# EAGLE design board (EAGLE 9.6.2)
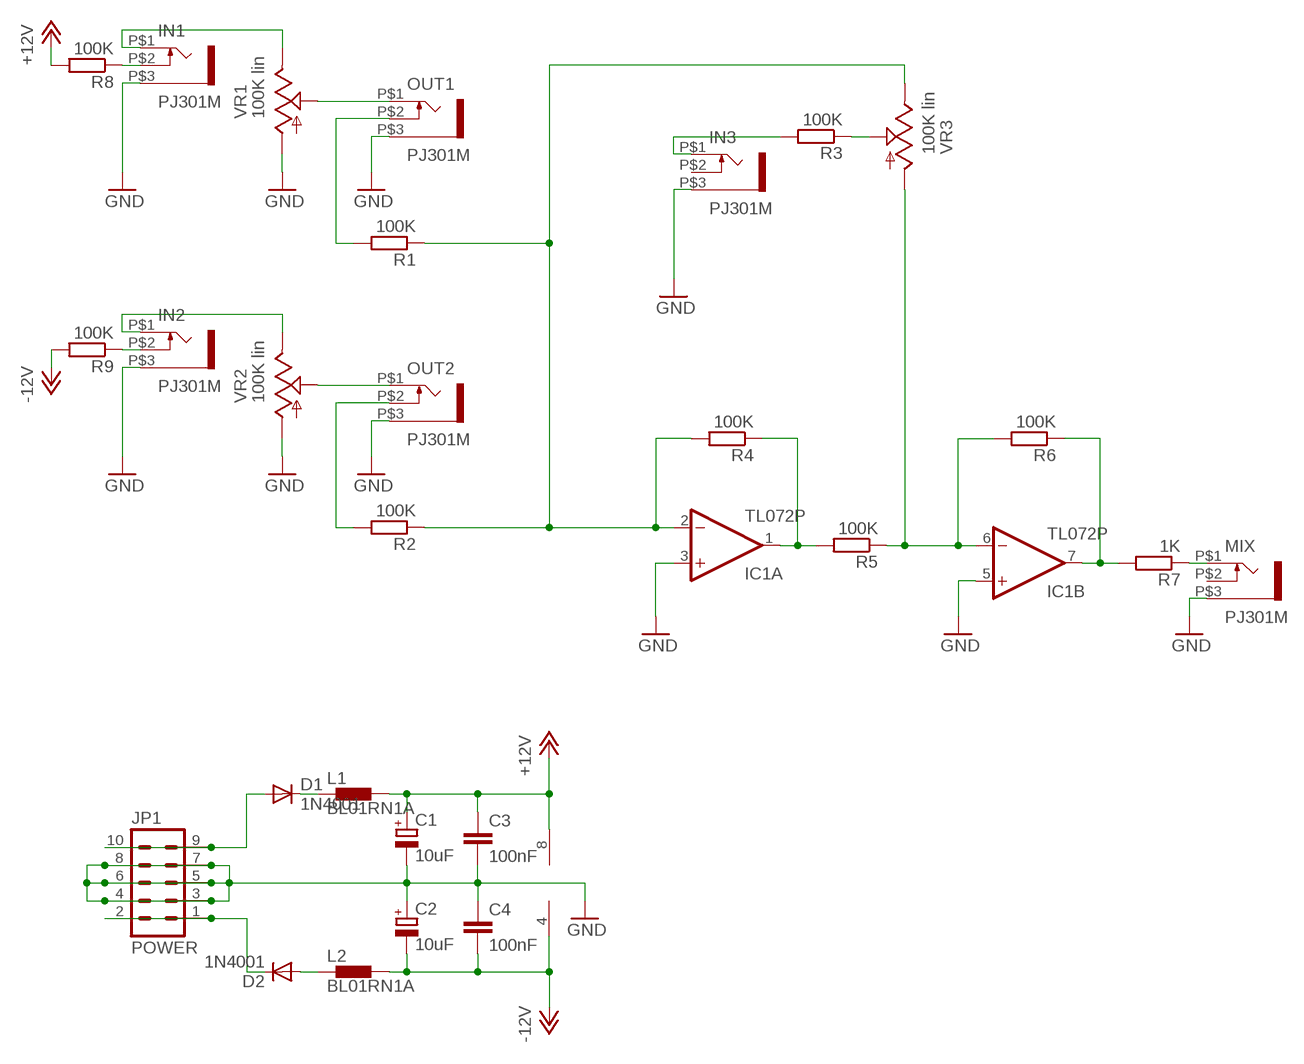
[diagram p0: schematic, sheet 1]

## Parts
C1  10uF  CPOL-EUE2,5-6E  [E2,5-6E]
C2  10uF  CPOL-EUE2,5-6E  [E2,5-6E]
C3  100nF  C-EU025-024X044  [C025-024X044]
C4  100nF  C-EU025-024X044  [C025-024X044]
D1  1N4001  1N4004  [DO41-10]
D2  1N4001  1N4004  [DO41-10]
IC1  TL072P  [DIL08]
IN1  PJ301M  WQP-PJ301M-12_JACK  [WQP-PJ301M-12_JACK]
IN2  PJ301M  WQP-PJ301M-12_JACK  [WQP-PJ301M-12_JACK]
IN3  PJ301M  WQP-PJ301M-12_JACK  [WQP-PJ301M-12_JACK]
JP1  POWER  EURO_POWER_HEADERFAT_PADS  [EURO_PWR_HEADER_FAT]
L1  BL01RN1A  [BL01RN1A]
L2  BL01RN1A  [BL01RN1A]
MIX  PJ301M  WQP-PJ301M-12_JACK  [WQP-PJ301M-12_JACK]
OUT1  PJ301M  WQP-PJ301M-12_JACK  [WQP-PJ301M-12_JACK]
OUT2  PJ301M  WQP-PJ301M-12_JACK  [WQP-PJ301M-12_JACK]
R1  100K  R-EU_0204/5  [0204/5]
R2  100K  R-EU_0204/5  [0204/5]
R3  100K  R-EU_0204/5  [0204/5]
R4  100K  R-EU_0204/5  [0204/5]
R5  100K  R-EU_0204/5  [0204/5]
R6  100K  R-EU_0204/5  [0204/5]
R7  1K  R-EU_0204/5  [0204/5]
R8  100K  R-EU_0204/5  [0204/5]
R9  100K  R-EU_0204/5  [0204/5]
VR1  100K lin  9MM_SNAP-IN_POT_  [9MM_SNAP-IN_POT]
VR2  100K lin  9MM_SNAP-IN_POT_  [9MM_SNAP-IN_POT]
VR3  100K lin  9MM_SNAP-IN_POT_  [9MM_SNAP-IN_POT]

## Nets
+12V: C1.+ C3.1 IC1.8(P:V+) L1.2 R8.2
-12V: C2.- C4.2 IC1.4(P:V-) L2.2 R9.2
GND: C1.- C2.+ C3.2 C4.1 IC1.3(A:+IN) IC1.5(B:+IN) IN1.P$3 IN2.P$3 IN3.P$3 JP1.3 JP1.4 JP1.5 JP1.6 JP1.7 JP1.8 MIX.P$3 OUT1.P$3 OUT2.P$3 VR1.1(A) VR2.1(A)
MIX+: MIX.P$1 R7.1
MIXER: IC1.2(A:-IN) R1.1 R2.1 R4.2 VR3.3(E)
N$1: D1.A JP1.9 JP1.10
N$2: D2.C JP1.1 JP1.2
N$3: D1.C L1.1
N$4: D2.A L2.1
N$5: IN1.P$1 VR1.3(E)
N$6: IN2.P$1 VR2.3(E)
N$7: OUT1.P$1 VR1.2(S)
N$8: OUT2.P$1 VR2.2(S)
N$9: IN3.P$1 R3.2
N$10: R3.1 VR3.2(S)
N$11: IN2.P$2 R9.1
N$12: IN1.P$2 R8.1
N$14: OUT1.P$2 R1.2
N$15: OUT2.P$2 R2.2
N$19: IC1.1(A:OUT) R4.1 R5.2
N$20: IC1.6(B:-IN) R5.1 R6.2 VR3.1(A)
N$21: IC1.7(B:OUT) R6.1 R7.2
Unconnected: IN3.P$2 MIX.P$2

## Library data of the parts
C1 C2 = rcl:CPOL-EU: POLARIZED CAPACITOR, European symbol; MF: NICHICON; MPN: UVR2A100MED1TD; OC_FARNELL: 1822773; SPICEPREFIX: C
C3 C4 = rcl:C-EU: CAPACITOR, European symbol; MF: MULTICOMP; MPN: MC0805Y104M500A2.54MM; OC_FARNELL: 2112751; SPICEPREFIX: C
D1 D2 = diode:1N4004: DIODE general purpose rectifier, 1 A; MF: VISHAY; MPN: 1N4001-E3/54; OC_FARNELL: 2889052
IC1 = linear:TL072: OP AMP; MF: TEXAS INSTRUMENTS; MPN: TL072IP; OC_FARNELL: 3117794
IN1-IN3 MIX OUT1 OUT2 = thonkiconn:WQP-PJ301M-12_JACK; OC_FARNELL: unknown
JP1 = MusicThingModular:EURO_POWER_HEADER: Power Header 10 pin power header for Eurorack Power Supplies Variants with fatter pads for easier soldering, and the LOCK variant which has 5mil offset pins to hold the component in place before soldering; MF: MULTICOMP PRO; MPN: 2213S-10G; OC_FARNELL: 1593442
L1 L2 = inductors:BL0: Noise Suppression Products/EMI Suppression Filters, Lead EMIFIL(R) Inductor Type Source: http://www.murata.com .. BL01RN1_DS.pdf; MF: MURATA; MPN: BL01RN1A1D2B; OC_FARNELL: 9526820
R1-R6 R8 R9 = rcl:R-EU_: RESISTOR, European symbol; MF: TE CONNECTIVITY; MPN: LR0204F100K; OC_FARNELL: 2329853; SPICEPREFIX: R
R7 = rcl:R-EU_: RESISTOR, European symbol; MF: TE CONNECTIVITY; MPN: LR0204F1K0; OC_FARNELL: 2329885; SPICEPREFIX: R
VR1-VR3 = MusicThingModular:9MM_SNAP-IN_POT: 9mm vertical snap-in pot, Alpha / Panasonic style; OC_FARNELL: unknown

## Board
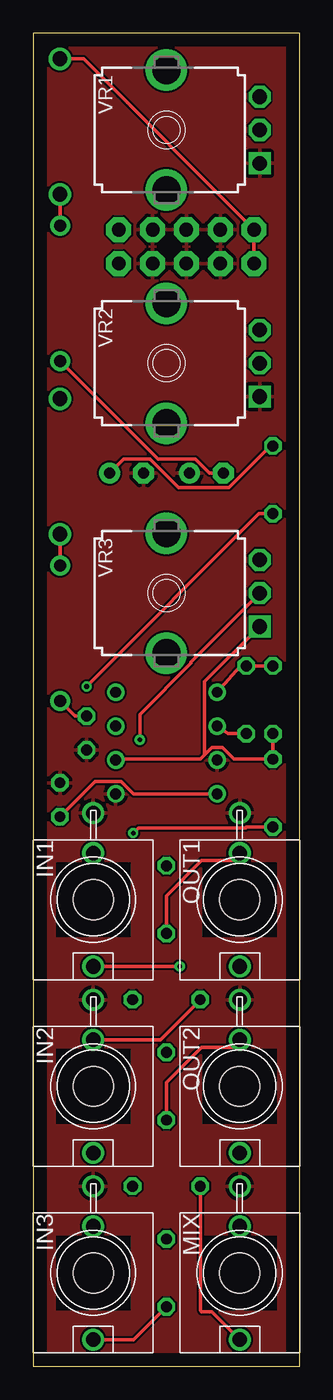
[diagram p1: board, top side]
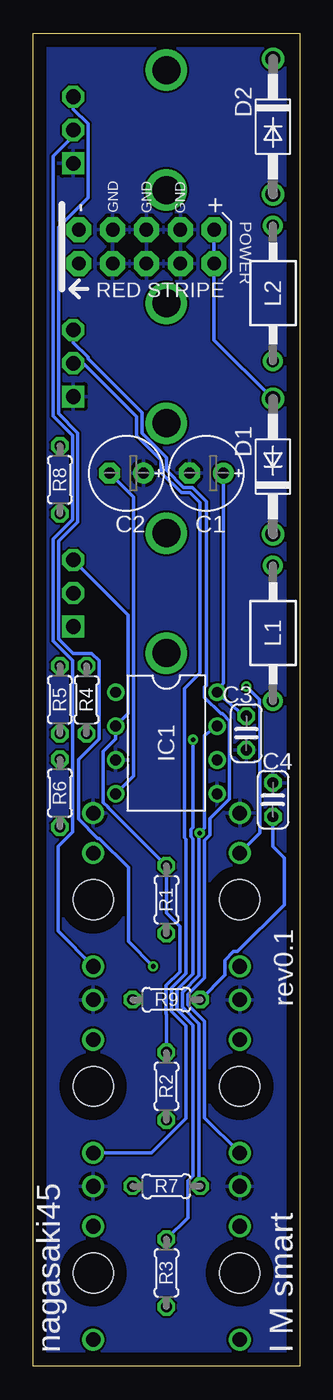
[diagram p2: board, bottom side, seen from below]

Size 20 x 100 mm. Coordinates in mm from the lower left corner, seen from the top.
Outline: 0,0 20,0 20,100 0,100 0,0
Copper layers (1*16): Top 0.035mm / dielectric 1.5mm / Bottom 0.035mm
Design rules "default": minimum track width 6mil, minimum drill 0.35mm, track to track 6mil, track to pad 6mil, pad to pad 6mil, via to via 6mil, smd to smd 6mil, copper to edge 40mil, drill to drill 6mil, minimum pad ring 10mil, minimum via ring 8mil, stop-mask expansion 4mil, vias tented up to drill 0mil, thermal gap 10mil
Holes 3 mm at 4.5,35 15.5,35 15.5,21 4.5,21 15.5,7 4.5,7

### Footprints (pad centres in the part's own frame; a part is rotated, then mirrored left to right if it is on the bottom)
E2,5-6E = drill 0.813 pad 1.575: + -1.27,0 | drill 0.813 pad 1.575 octagon: - 1.27,0
C025-024X044 = drill 0.813 octagon: 1 -1.27,0; 2 1.27,0
DO41-10 = drill 1.118: A 5.08,0; C -5.08,0
DIL08 = drill 0.813 pad 1.27: 1 -3.81,-3.81; 2 -1.27,-3.81; 3 1.27,-3.81; 4 3.81,-3.81; 5 3.81,3.81; 6 1.27,3.81; 7 -1.27,3.81; 8 -3.81,3.81
WQP-PJ301M-12_JACK = drill 1.1: P$1 0,5; P$2 0,-3.5; P$3 0,-6.5
EURO_PWR_HEADER_FAT = drill 1.016 pad 1.88 octagon: 1 -5.08,-1.27; 2 -5.08,1.27; 3 -2.54,-1.27; 4 -2.54,1.27; 5 0,-1.27; 6 0,1.27; 7 2.54,-1.27; 8 2.54,1.27; 9 5.08,-1.27; 10 5.08,1.27
BL01RN1A = drill 0.9 pad 1.5: 1 -5.08,0; 2 5.08,0
0204/5 = drill 0.813 octagon: 1 -2.54,0; 2 2.54,0
9MM_SNAP-IN_POT = drill 1.1 square: 1 -2.5,-7 | drill 1.1 octagon: 2 0,-7; 3 2.5,-7 | drill 2.1 pad 2.794: CHASSIS1 -4.5,0; CHASSIS2 4.5,0

### Placement (x,y rotation side)
C1  7,67 180 bottom
C2  13,67 180 bottom
C3  4,47.5 270 bottom
C4  2,42.5 270 bottom
D1  2,67.5 90 bottom
D2  2,93 270 bottom
IC1  10,46.75 270 bottom
IN1  4.5,35 180 top
IN2  4.5,21 180 top
IN3  4.5,7 180 top
JP1  11.5,84 0 bottom
L1  2,55 270 bottom
L2  2,80.5 270 bottom
MIX  15.5,7 180 top
OUT1  15.5,35 180 top
OUT2  15.5,21 180 top
R1  10,35 270 bottom
R2  10,21 270 bottom
R3  10,7 270 bottom
R4  16,50 270 bottom
R5  18,50 90 bottom
R6  18,43 90 bottom
R7  10,13.5 0 bottom
R8  18,66.5 90 bottom
R9  10,27.5 0 bottom
VR1  10,92.75 90 top
VR2  10,75.25 90 top
VR3  10,58 90 top

### Tracks (layer width: path | path; a pad name or v marks a point on that pad's centre or on a via)
+12V
  Top 0.254: L1.2 3.15,48.77 C3.1 | C1.+ 6.8,68.07 8.78,68.07 10.91,65.93 14.71,65.93 17.82,69.04 R8.2
  Bottom 0.254: C1.+ 5.73,51.27 IC1.8 4.15,48.77 C3.1
-12V
  Top 0.254: C2.- 13.24,67 12.17,68.07 9.35,68.07 L2.2 | IC1.4 7.52,42.94 6.58,43.88 4.65,43.88 C4.2
  Bottom 0.254: C4.2 2,39 1.14,38.14 1.14,34.62 4.66,31.1 4.96,31.1 5.6,30.46 5.6,29.36 R9.2 | C2.- 12.46,65.19 12.46,44.29 IC1.4
GND
  pour Top: -1,101 -1,-1 21,-1 21,101
  pour Bottom: -1,101 -1,-1 21,-1 21,101
MIX+
  Top 0.254: MIX.P$1 13.43,4.07 12.65,4.07 12.54,4.18 R7.1
MIXER
  Top 0.254: R4.2 14.62,47.46 IC1.2
  Bottom 0.254: VR3.3 12.87,56.37 12.87,48.96 IC1.2 13.81,47.06 14.75,46.12 14.75,42.31 14.4,41.96 14.4,41.94 R1.1 10,34 9,33 9,29.59 10.03,28.56 10.03,26.44 10,26.41 R2.1
N$1
  Bottom 0.254: D1.A 6.42,77 JP1.9 JP1.10
N$2
  Top 0.254: D2.C 3.77,98.08 JP1.2 JP1.1
N$3
  Top 0.254: D1.C L1.1
N$4
  Top 0.254: D2.A L2.1
N$5  (via drill 0.35)
  Top 0.254: IN1.P$1 v11,30
  Bottom 0.254: VR1.3 17,94.31 15.9,93.21 15.9,87.68 18.1,85.47 18.1,71.45 16.65,70 16.65,63.35 18.1,61.9 18.1,54.56 17.02,53.48 15.61,53.48 15.06,52.93 15.06,47.07 16.6,45.53 16.6,41.04 15.17,39.6 15.04,39.6 12.86,37.42 12.86,31.86 v11,30
N$6
  Bottom 0.254: IN2.P$1 7.14,18.64 7.14,25.85 8.4,27.11 8.4,27.89 7.14,29.15 7.14,39.43 6.72,39.85 6.72,41.08 5.25,42.55 5.25,48.41 5.8,48.96 5.92,48.96 7.13,50.17 7.13,50.95 7,51.08 7,64.87 8.06,65.93 8.71,65.93 10,67.22 10,68.15 11.84,69.99 11.84,71.55 15.9,75.6 15.9,75.71 17,76.81 VR2.3
N$7
  Bottom 0.254: VR1.2 17,92.3 17.65,91.65 18.51,90.78 18.51,71.28 17.06,69.83 17.06,63.52 18.51,62.06 18.51,54.39 17.06,52.94 17.06,40.07 18.14,38.99 18.14,32.64 OUT1.P$1
N$8
  Bottom 0.254: OUT2.P$1 11.13,16 8.54,18.59 8.54,25.52 9.62,26.61 9.62,28.39 8.54,29.48 8.54,39.53 8.66,39.65 8.66,50.84 7.5,52 7.5,64.8 8.23,65.53 8.88,65.53 10.41,67.05 10.41,67.98 12.24,69.82 12.24,71.24 16.25,75.25 VR2.2
N$9
  Top 0.254: R3.2 7.54,2 IN3.P$1
N$10  (via drill 0.35)
  Top 0.254: VR3.2 11.84,52.84 11.84,52.74 8,48.9 v8,47
  Bottom 0.254: R3.1 8.4,11.14 8.4,13.89 8,14.29 8,25.56 9.21,26.77 9.21,28.23 8,29.44 8,39.57 8.16,39.73 8.16,40.27 8,40.43 v8,47
N$11
  Top 0.254: R9.1 9.54,24.5 IN2.P$2
N$12  (via drill 0.35)
  Top 0.254: R8.1 16.96,63.96 v4,51
  Bottom 0.254: v4,51 3.03,50.03 3.03,49.49 3,49.46 3,40 IN1.P$2
N$14
  Top 0.254: OUT1.P$2 14.93,37.93 12.65,37.93 10,35.28 R1.2
N$15
  Top 0.254: OUT2.P$2 14.93,23.93 12.65,23.93 10,21.28 R2.2
N$19
  Top 0.254: IC1.1 15.54,52.54 R4.1 R5.2
N$20
  Top 0.254: R5.1 R6.2 15.08,45.54 14.2,46.42 13.42,46.42 12.87,45.87 | VR3.1 12.87,51.37 12.87,45.87 | IC1.6 6.25,45.54 12.54,45.54 12.87,45.87
N$21  (via drill 0.35)
  Top 0.254: R6.1 16.02,40.46 15.96,40.4 7.9,40.4 v7.5,40
  Bottom 0.254: R7.2 7.55,13.59 7.55,25.69 8.81,26.94 8.81,28.06 7.55,29.31 7.55,39.95 v7.5,40 7.13,40.37 7.13,47.33 IC1.7

### Text on the board
bPlace: rev0.1 | I M smart | nagasaki45